# Altium project Smart_Clock.PrjPcb
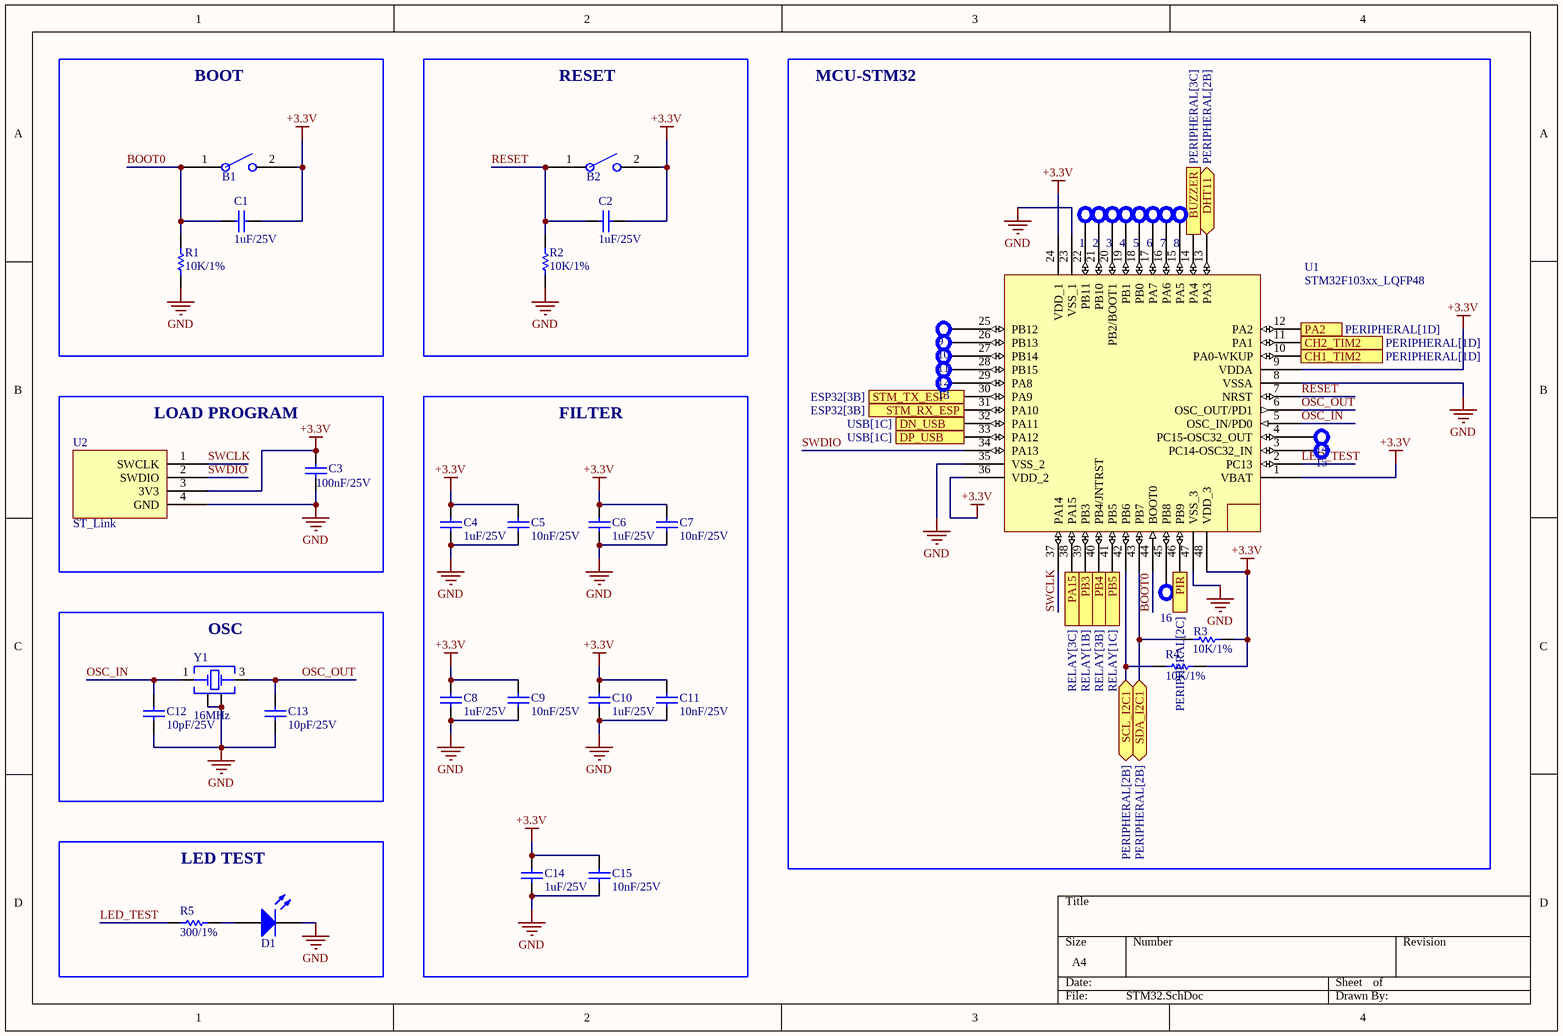
[diagram p0: STM32.SchDoc]
6 sheets, 123 parts. Net scope: flat (ports and power ports of the same name join across sheets).
Board file: Smart_Clock_PCB.PcbDoc
Sheets:
  STM32.SchDoc
  ESP32.SchDoc
  USB.SchDoc
  PERIPHERAL.SchDoc
  RELAY.SchDoc
  POWER_SUPPLY.SchDoc

## Sheet STM32.SchDoc
size A4; SheetNumber: 1; SheetTotal: 6

### Parts
1  Test Point  [TP]  (value not drawn)  (no BOM)
2  Test Point  [TP]  (value not drawn)  (no BOM)
3  Test Point  [TP]  (value not drawn)  (no BOM)
4  Test Point  [TP]  (value not drawn)  (no BOM)
5  Test Point  [TP]  (value not drawn)  (no BOM)
6  Test Point  [TP]  (value not drawn)  (no BOM)
7  Test Point  [TP]  (value not drawn)  (no BOM)
8  Test Point  [TP]  (value not drawn)  (no BOM)
9  Test Point  [TP]  (value not drawn)  (no BOM)
10  Test Point  [TP]  (value not drawn)  (no BOM)
11  Test Point  [TP]  (value not drawn)  (no BOM)
12  Test Point  [TP]  (value not drawn)  (no BOM)
13  Test Point  [TP]  (value not drawn)  (no BOM)
14  Test Point  [TP]  (value not drawn)  (no BOM)
15  Test Point  [TP]  (value not drawn)  (no BOM)
16  Test Point  [TP]  (value not drawn)  (no BOM)
B1  Button SMD 2 Pin 3x4mm  [BUTTON SMD 2 PIN]  (value not drawn)
B2  Button SMD 2 Pin 3x4mm  [BUTTON SMD 2 PIN]  (value not drawn)
C1  value 1uF/25V  [CAP-SM-0805]  (hidden comment: Cap Non-Pol SMD)
C2  value 1uF/25V  [CAP-SM-0805]  (hidden comment: Cap Non-Pol SMD)
C3  value 100nF/25V  [CAP-SM-0805]  (hidden comment: Cap Non-Pol SMD)
C4  value 1uF/25V  [CAP-SM-0805]  (hidden comment: Cap Non-Pol SMD)
C5  value 10nF/25V  [CAP-SM-0805]  (hidden comment: Cap Non-Pol SMD)
C6  value 1uF/25V  [CAP-SM-0805]  (hidden comment: Cap Non-Pol SMD)
C7  value 10nF/25V  [CAP-SM-0805]  (hidden comment: Cap Non-Pol SMD)
C8  value 1uF/25V  [CAP-SM-0805]  (hidden comment: Cap Non-Pol SMD)
C9  value 10nF/25V  [CAP-SM-0805]  (hidden comment: Cap Non-Pol SMD)
C10  value 1uF/25V  [CAP-SM-0805]  (hidden comment: Cap Non-Pol SMD)
C11  value 10nF/25V  [CAP-SM-0805]  (hidden comment: Cap Non-Pol SMD)
C12  value 10pF/25V  [CAP-SM-0805]  (hidden comment: Cap Non-Pol SMD)
C13  value 10pF/25V  [CAP-SM-0805]  (hidden comment: Cap Non-Pol SMD)
C14  value 1uF/25V  [CAP-SM-0805]  (hidden comment: Cap Non-Pol SMD)
C15  value 10nF/25V  [CAP-SM-0805]  (hidden comment: Cap Non-Pol SMD)
D1  LED SMD  [LED_0805_Blue]  (value not drawn)
R1  value 10K/1%  [RES-SM-0805]  (hidden comment: RESISTOR SMD)
R2  value 10K/1%  [RES-SM-0805]  (hidden comment: RESISTOR SMD)
R3  value 10K/1%  [RES-SM-0805]  (hidden comment: RESISTOR SMD)
R4  value 10K/1%  [RES-SM-0805]  (hidden comment: RESISTOR SMD)
R5  value 300/1%  [RES-SM-0805]  (hidden comment: RESISTOR SMD)
U1  STM32F103xx_LQFP48  [STM32_LQPF48]
U2  ST_Link  [Header 4 Pin]
Y1  16MHz  [WE-XTAL_CFPX-180]

### Blocks framed on the sheet
BOOT: B1 C1 R1
RESET: B2 C2 R2
LOAD PROGRAM: C3 U2
FILTER: C4-C11 C14 C15
OSC: C12 C13 Y1
LED TEST: D1 R5

### Ports
BUZZER (out, see PERIPHERAL[3C]), CH1_TIM2 (in, see PERIPHERAL[1D]), CH2_TIM2 (in, see PERIPHERAL[1D]), DHT11 (bidir, see PERIPHERAL[2B]), DN_USB (in, see USB[1C]), DP_USB (in, see USB[1C]), PA2 (in, see PERIPHERAL[1D]), PA15 (out, see RELAY[3C]), PB3 (out, see RELAY[1B]), PB4 (out, see RELAY[3B]), PB5 (out, see RELAY[1C]), PIR (in, see PERIPHERAL[2C]), SCL_I2C1 (bidir, see PERIPHERAL[2B]), SDA_I2C1 (bidir, see PERIPHERAL[2B]), STM_RX_ESP (in, see ESP32[3B]), STM_TX_ESP (out, see ESP32[3B])

### Nets
+3.3V: B1.2 B2.2 C1.2 C2.2 C3.2 C4.2 C5.2 C6.2 C7.2 C8.2 C9.2 C10.2 C11.2 C14.2 C15.2 R3.1 R4.1 U1.1(VBAT) U1.9(VDDA) U1.24(VDD_1) U1.36(VDD_2) U1.48(VDD_3) U2.3(3V3)
GND: C3.1 C4.1 C5.1 C6.1 C7.1 C8.1 C9.1 C10.1 C11.1 C12.2 C13.2 C14.1 C15.1 D1.2(K) R1.1 R2.1 U1.8(VSSA) U1.23(VSS_1) U1.35(VSS_2) U1.47(VSS_3) U2.4(GND) Y1.2(GND) Y1.4(GND)
BOOT0: B1.1 C1.1 R1.2 U1.44(BOOT0)
LED_TEST: R5.1 U1.2(PC13)
OSC_IN: C12.1 U1.5(OSC_IN/PD0) Y1.1(Crystal)
OSC_OUT: C13.1 U1.6(OSC_OUT/PD1) Y1.3(Crystal)
RESET: B2.1 C2.1 R2.2 U1.7(NRST)
SWCLK: U1.37(PA14) U2.1(SWCLK)
SWDIO: U1.34(PA13) U2.2(SWDIO)
Net1_1: 1.1 U1.22(PB11)
Net2_1: 2.1 U1.21(PB10)
Net3_1: 3.1 U1.20(PB2/BOOT1)
Net4_1: 4.1 U1.19(PB1)
Net5_1: 5.1 U1.18(PB0)
Net6_1: 6.1 U1.17(PA7)
Net7_1: 7.1 U1.16(PA6)
Net8_1: 8.1 U1.15(PA5)
Net9_1: 9.1 U1.25(PB12)
Net10_1: 10.1 U1.26(PB13)
Net11_1: 11.1 U1.27(PB14)
Net12_1: 12.1 U1.28(PB15)
Net13_1: 13.1 U1.29(PA8)
Net14_1: 14.1 U1.4(PC15-OSC32_OUT)
Net15_1: 15.1 U1.3(PC14-OSC32_IN)
Net16_1: 16.1 U1.45(PB8)
Net*1_27: U1.31(PA10) ; port STM_RX_ESP
Net*1_28: U1.30(PA9) ; port STM_TX_ESP
NetD1_1: D1.1(A) R5.2
NetD4_1: U1.46(PB9) ; port PIR
NetD7_2: U1.39(PB3) ; port PB3
NetD8_2: U1.40(PB4/JNTRST) ; port PB4
NetD11_2: U1.41(PB5) ; port PB5
NetD12_2: U1.38(PA15) ; port PA15
NetR3_2: R3.2 U1.43(PB7) ; port SDA_I2C1
NetR4_2: R4.2 U1.42(PB6) ; port SCL_I2C1
NetR11_1: U1.13(PA3) ; port DHT11
NetR12_1: U1.14(PA4) ; port BUZZER
NetSW1_5: U1.33(PA12) ; port DP_USB
NetSW1_8: U1.32(PA11) ; port DN_USB
NetU1_10: U1.10(PA0-WKUP) ; port CH1_TIM2
NetU1_11: U1.11(PA1) ; port CH2_TIM2
NetU1_12: U1.12(PA2) ; port PA2

### Notes on the sheet
- MCU-STM32

### Library data of the parts
B1 B2 = BUTTON
C1-C15 = Cap Non-Pol SMD: Capacitor
D1 = LED SMD: LED
R1-R5 = RESISTOR SMD: Resistor
Y1 = 073525166008: WE-XTAL Quartz Crystal, SMT, CFPX-180, 16MHz, +/-20ppm; Manufacturer Part Number: NX3225SA-16.000M-STD-CRS-2; Manufacturer: NDK; Frequency Stability: +/-50ppm; Load Capacitance: 8pF; Frequency Tolerance: +/-15ppm; ComponentLink2Description: Supplier 1 URL; ComponentLink2URL: https://www.mouser.com/ProductDetail/NDK/NX3225SA-16.000M-STD-CRS-2?qs=55YtniHzbhB2yRxaVPeqhg%3D%3D; Operating Temperature: -10 to +60degC; Size: CFPX-104/5032; Frequency: 16MHz; Mounting Technology: SMT; Supplier 3 Name: thegioiic; Supplier 3 SN: N/A; Supplier 3 URL: https://www.thegioiic.com/thach-anh-16mhz-5032-4-chan-smd; ComponentLink1Description: Datasheet link; ComponentLink1URL: https://www.mouser.com/datasheet/2/905/c_NX3225SA_e-1317523.pdf; ComponentLink3Description: Supplier 2 URL; ComponentLink3URL: https://www.digikey.com/en/products/detail/ndk-america-inc/NX3225SA-16-000M-STD-CRS-2/1788469; ComponentLink4Description: Supplier 3 URL; ComponentLink4URL: https://www.thegioiic.com/thach-anh-16mhz-5032-4-chan-smd; Supplier 1 Name: Mouser; Supplier 1 SN: 344-NX3225SA16MCRS2; Supplier 1 URL: https://www.mouser.com/ProductDetail/NDK/NX3225SA-16.000M-STD-CRS-2?qs=55YtniHzbhB2yRxaVPeqhg%3D%3D; Supplier 2 Name: Digi-Key; Supplier 2 SN: 644-1129-2-ND; Supplier 2 URL: https://www.digikey.com/en/products/detail/ndk-america-inc/NX3225SA-16-000M-STD-CRS-2/1788469; Value: 16MHz
1-16 = Test Point: Value: Test Point
U1 = STM32F103xx_LQFP48: Published: 30-May-2008; DatasheetVersion: rev6, Mar-2008; PackageVersion: Mar-2008; PackageReference: LQFP48; Publisher: Altium Limited; PackageDescription: 48-Pin Low-Profile Quad Flat Pack, 7 x 7 mm Body, 0.5 mm Pitch (LQFP48); ComponentLink1Description: Manufacturer Link; ComponentLink1URL: www.st.com/stm32; ComponentLink2Description: Datasheet; ComponentLink2URL: http://www.st.com/stonline/products/literature/ds/13587.pdf

## Sheet ESP32.SchDoc
size A; SheetNumber: 2; SheetTotal: 6
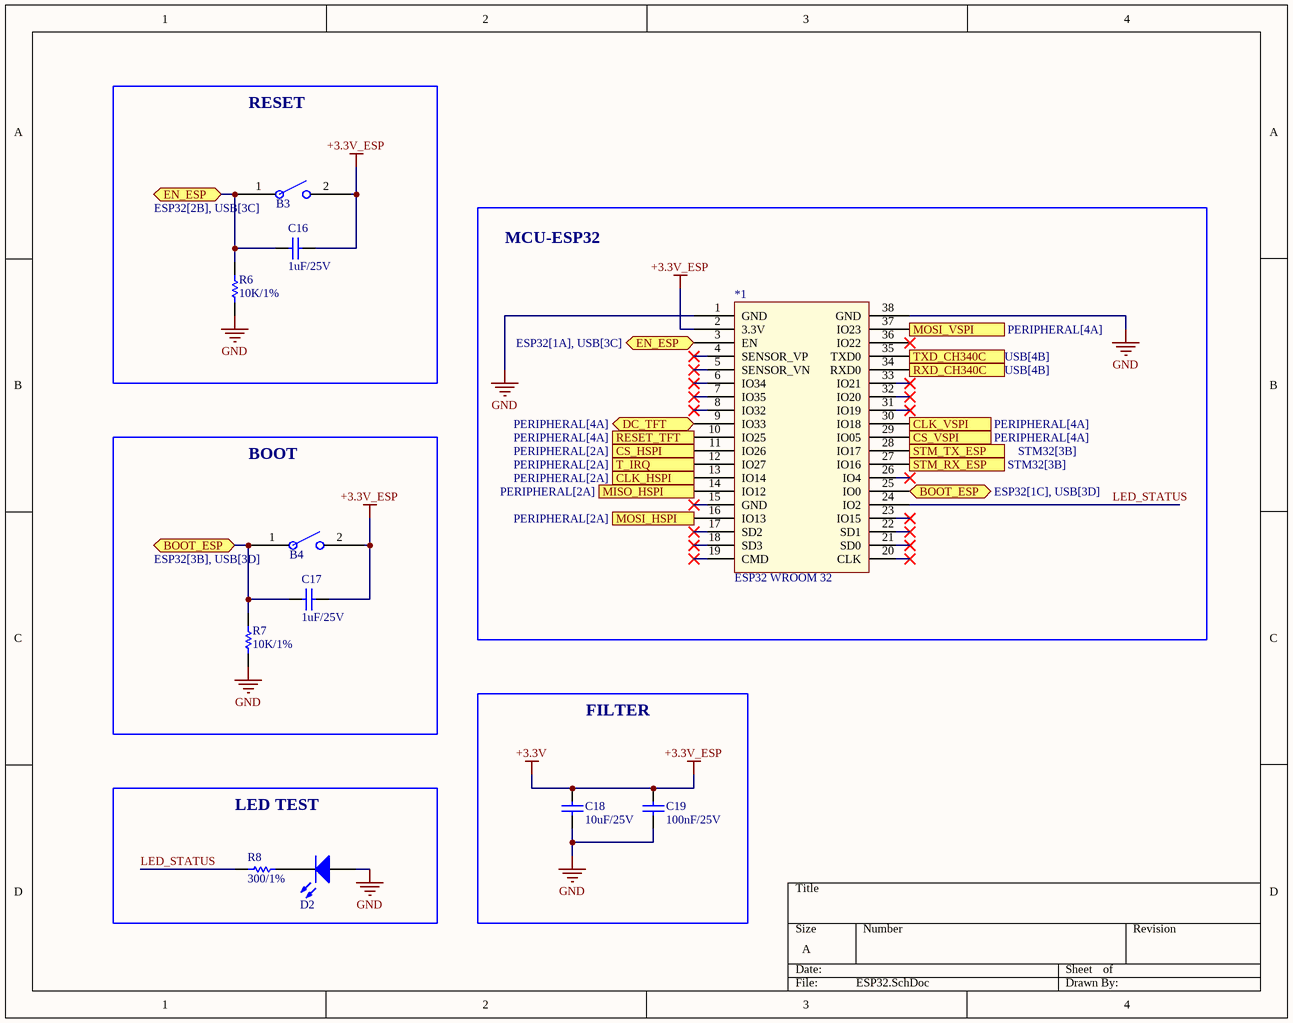
[diagram p1: ESP32.SchDoc]

### Parts
*1  ESP32 WROOM 32  [ESP32-WROOM-32D]
B3  Button SMD 2 Pin 3x4mm  [BUTTON SMD 2 PIN]  (value not drawn)
B4  Button SMD 2 Pin 3x4mm  [BUTTON SMD 2 PIN]  (value not drawn)
C16  value 1uF/25V  [CAP-SM-0805]  (hidden comment: Cap Non-Pol SMD)
C17  value 1uF/25V  [CAP-SM-0805]  (hidden comment: Cap Non-Pol SMD)
C18  value 10uF/25V  [CAP-SM-0805]  (hidden comment: Cap Non-Pol SMD)
C19  value 100nF/25V  [CAP-SM-0805]  (hidden comment: Cap Non-Pol SMD)
D2  LED SMD  [LED_0805_Blue]  (value not drawn)
R6  value 10K/1%  [RES-SM-0805]  (hidden comment: RESISTOR SMD)
R7  value 10K/1%  [RES-SM-0805]  (hidden comment: RESISTOR SMD)
R8  value 300/1%  [RES-SM-0805]  (hidden comment: RESISTOR SMD)

### Blocks framed on the sheet
RESET: B3 C16 R6
MCU-ESP32: *1
BOOT: B4 C17 R7
FILTER: C18 C19
LED TEST: D2 R8

### Ports
BOOT_ESP (bidir, see ESP32[1C], USB[3D]), BOOT_ESP (bidir, see ESP32[3B], USB[3D]), CLK_HSPI (out, see PERIPHERAL[2A]), CLK_VSPI (out, see PERIPHERAL[4A]), CS_HSPI (out, see PERIPHERAL[2A]), CS_VSPI (out, see PERIPHERAL[4A]), DC_TFT (bidir, see PERIPHERAL[4A]), EN_ESP (bidir, see ESP32[1A], USB[3C]), EN_ESP (bidir, see ESP32[2B], USB[3C]), MISO_HSPI (in, see PERIPHERAL[2A]), MOSI_HSPI (out, see PERIPHERAL[2A]), MOSI_VSPI (out, see PERIPHERAL[4A]), RESET_TFT (out, see PERIPHERAL[4A]), RXD_CH340C (out, see USB[4B]), STM_RX_ESP (out, see STM32[3B]), STM_TX_ESP (in, see STM32[3B]), T_IRQ (in, see PERIPHERAL[2A]), TXD_CH340C (in, see USB[4B])

### Nets
+3.3V: *1.2(3.3V) B3.2 B4.2 C16.2 C17.2 C18.2 C19.2  [also labelled +3.3V_ESP]
GND: *1.1(GND) *1.38(GND) C18.1 C19.1 D2.1(A) R6.1 R7.1
LED_STATUS: *1.24(IO2) R8.1
Net*1_3: *1.3(EN) B3.1 C16.1 R6.2 ; port EN_ESP
Net*1_9: *1.9(IO33) ; port DC_TFT
Net*1_10: *1.10(IO25) ; port RESET_TFT
Net*1_11: *1.11(IO26) ; port CS_HSPI
Net*1_12: *1.12(IO27) ; port T_IRQ
Net*1_13: *1.13(IO14) ; port CLK_HSPI
Net*1_14: *1.14(IO12) ; port MISO_HSPI
Net*1_16: *1.16(IO13) ; port MOSI_HSPI
Net*1_25: *1.25(IO0) B4.1 C17.1 R7.2 ; port BOOT_ESP
Net*1_27: *1.27(IO16) ; port STM_RX_ESP
Net*1_28: *1.28(IO17) ; port STM_TX_ESP
Net*1_29: *1.29(IO05) ; port CS_VSPI
Net*1_30: *1.30(IO18) ; port CLK_VSPI
Net*1_34: *1.34(RXD0) ; port RXD_CH340C
Net*1_35: *1.35(TXD0) ; port TXD_CH340C
Net*1_37: *1.37(IO23) ; port MOSI_VSPI
NetD2_2: D2.2(K) R8.2

Not connected (* = marked no-connect by the designer): *1 4(SENSOR_VP)* 5(SENSOR_VN)* 6(IO34)* 7(IO35)* 8(IO32)* 15(GND)* 17(SD2)* 18(SD3)* 19(CMD)* 20(CLK)* 21(SD0)* 22(SD1)* 23(IO15)* 26(IO4)* 31(IO19)* 32(IO20)* 33(IO21)* 36(IO22)*

### Library data of the parts
B3 B4 = BUTTON
C16-C19 = Cap Non-Pol SMD: Capacitor
D2 = LED SMD: LED
R6-R8 = RESISTOR SMD: Resistor

## Sheet USB.SchDoc
size A; SheetNumber: 3; SheetTotal: 6
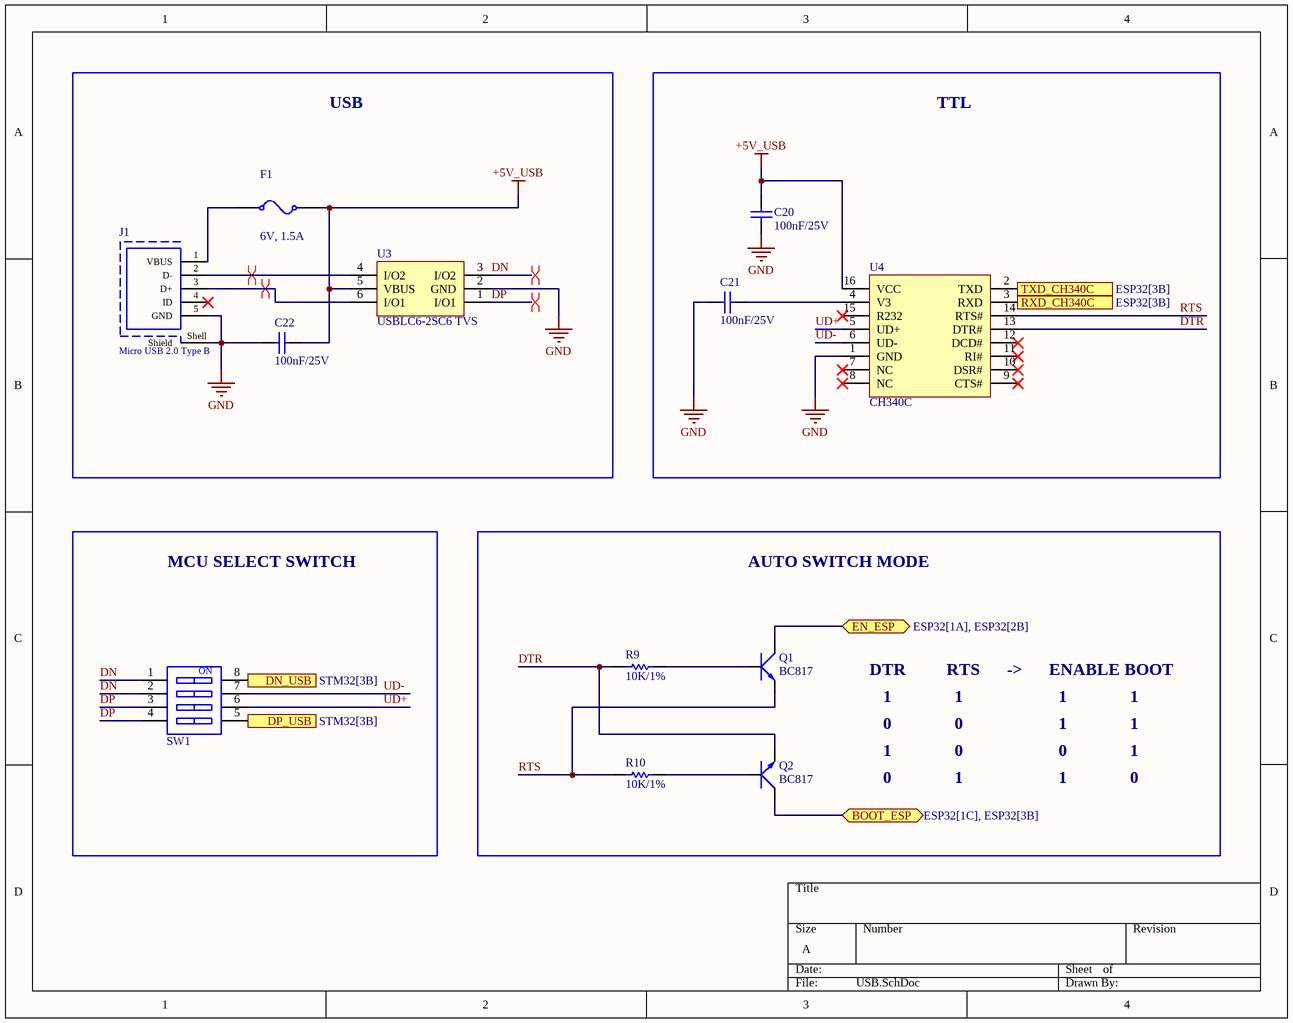
[diagram p2: USB.SchDoc]

### Parts
C20  value 100nF/25V  [CAP-SM-0805]  (hidden comment: Cap Non-Pol SMD)
C21  value 100nF/25V  [CAP-SM-0805]  (hidden comment: Cap Non-Pol SMD)
C22  value 100nF/25V  [CAP-SM-0805]  (hidden comment: Cap Non-Pol SMD)
F1  6V, 1.5A  [Fuse_SMD_1812]
J1  Micro USB 2.0 Type B  [629105150521]
Q1  BC817  [SOT-23]
Q2  BC817  [SOT-23]
R9  value 10K/1%  [RES-SM-0805]  (hidden comment: RESISTOR SMD)
R10  value 10K/1%  [RES-SM-0805]  (hidden comment: RESISTOR SMD)
SW1  418117270904  [418117270904]  (value not drawn)
U3  USBLC6-2SC6 TVS  [SOT23-6]
U4  CH340C  [SOIC16_50_284_25X90_SMT]

### Blocks framed on the sheet
USB: C22 F1 J1 U3
MCU SELECT SWITCH: SW1

### Ports
BOOT_ESP (bidir, see ESP32[1C], ESP32[3B]), DN_USB (out, see STM32[3B]), DP_USB (out, see STM32[3B]), EN_ESP (bidir, see ESP32[1A], ESP32[2B]), RXD_CH340C (in, see ESP32[3B]), TXD_CH340C (out, see ESP32[3B])

### Nets
+5V_USB: C20.1 C22.2 F1.1 U3.5(VBUS) U4.16(VCC)
GND: C20.2 C21.2 C22.1 J1.5(GND) J1.Shell(Shield) U3.2(GND) U4.1(GND)
DN: SW1.1 SW1.2 U3.3(I/O2)
DP: SW1.3 SW1.4 U3.1(I/O1)
DTR: Q2.2(E) R9.1 U4.13(DTR#)
RTS: Q1.2(E) R10.1 U4.14(RTS#)
UD+: SW1.6 U4.5(UD+)
UD-: SW1.7 U4.6(UD-)
Net*1_3: Q1.3(C) ; port EN_ESP
Net*1_25: Q2.3(C) ; port BOOT_ESP
Net*1_34: U4.3(RXD) ; port RXD_CH340C
Net*1_35: U4.2(TXD) ; port TXD_CH340C
NetC21_1: C21.1 U4.4(V3)
NetF1_0: F1.0 J1.1(VBUS)
NetJ1_2: J1.2(D-) U3.4(I/O2)
NetJ1_3: J1.3(D+) U3.6(I/O1)
NetQ1_1: Q1.1(B) R9.2
NetQ2_1: Q2.1(B) R10.2
NetSW1_5: SW1.5 ; port DP_USB
NetSW1_8: SW1.8 ; port DN_USB

Not connected (* = marked no-connect by the designer): J1 4(ID)*; U4 7(NC)* 8(NC)* 9(CTS#)* 10(DSR#)* 11(RI#)* 12(DCD#)* 15(R232)*

### Layout directives
differential pair: DN, DP, NetJ1_2, NetJ1_3

### Notes on the sheet
- TTL
- AUTO SWITCH MODE
- DTR         RTS      ->      ENABLE BOOT
- 1              1
- 0              0
- 1              0
- 0              1
- (in symbol 418117270904) ON

### Library data of the parts
C20-C22 = Cap Non-Pol SMD: Capacitor
F1 = 061812150024: Resettable Fuse, Size 1812, 24V, 1.5A; Manufacturer: Littelfuse; Threshold Current: 20A; Trip Current: 3A; Threshold Voltage: 24V; Hold Current: 1.5A; Size: 1812; Mounting Technology: SMT/SMD; ComponentLink1Description: Datasheet link; ComponentLink1URL: https://www.littelfuse.com/~/media/electronics/product_specifications/resettable_ptcs/littelfuse_ptc_minismdc300f_2_product_specification.pdf.pdf; ComponentLink2Description: Supplier 1 URL; ComponentLink2URL: https://www.mouser.vn/ProductDetail/Littelfuse/MINISMDC150F-24-2?qs=F6FIpiMdEVZ%2Fp37J%2FDHAxA%3D%3D; ComponentLink3Description: Supplier 2 URL; ComponentLink3URL: https://www.digikey.com/en/products/detail/littelfuse-inc/MINISMDC150F-24-2/1113513?s=N4IgTCBcDaILIEkByCDKcAiBhAjAVgAYAxAejABYBaCAXQF8g; ComponentLink4Description: Supplier 3 URL; ComponentLink4URL: https://www.thegioiic.com/cau-chi-tu-phuc-hoi-1812-24v-1-5a; Supplier 1 Name: Mouser; Supplier 1 SN: 650-MINISMDC150F/24; Supplier 1 URL: https://www.mouser.vn/ProductDetail/Littelfuse/MINISMDC150F-24-2?qs=F6FIpiMdEVZ%2Fp37J%2FDHAxA%3D%3D; Supplier 2 Name: Digi-Key; Supplier 2 SN: MINISMDC150F24-2TR-ND; Supplier 2 URL: https://www.mouser.vn/ProductDetail/Littelfuse/MINISMDC150F-24-2?qs=F6FIpiMdEVZ%2Fp37J%2FDHAxA%3D%3D; Supplier 3 Name: thegioiic; Supplier 3 SN: N/A; Supplier 3 URL: https://www.thegioiic.com/cau-chi-tu-phuc-hoi-1812-24v-1-5a; Value: 24V, 1.5A
J1 = 629105150521: Micro USB 2.0 Type B Receptacle WR-COM, Horizontal, SMT, with Pegs, High Current at Pin 1 & Pin 5; Rated Current: 3 A; Contact Resistance: 30 mOhm; Working Voltage: 30 VAC; ComponentLink1Description: Datasheet; ComponentLink1URL: https://katalog.we-online.de/em/datasheet/629105150521.pdf; ComponentLink2Description: Supplier 1 URL; ComponentLink2URL: N/A; Part Number: 629105150521; Published Date: September 2018; Publisher: Wurth Elektronik; Orientation: Horizontal; Connector Type: Micro USB 2.0 Type B; Operating Temperature: -40 to 85 degC; Mounting Technology: SMT; Gender: Receptacle; Packaging: Tape and Reel; ComponentLink3Description: Supplier 2 URL; ComponentLink3URL: N/A; ComponentLink4Description: Supplier 3 URL; ComponentLink4URL: N/A; Supplier 1 Name: Mouser; Supplier 1 SN: 710-629105150521; Supplier 1 URL: https://www.mouser.vn/ProductDetail/Wurth-Elektronik/629105150521?qs=a9WhcLg8qCzXiH7kZP8GRQ%3D%3D; Supplier 2 Name: Digi-Key; Supplier 2 SN: N/A; Supplier 2 URL: N/A; Supplier 3 Name: thegioiic; Supplier 3 SN: N/A; Supplier 3 URL: N/A; Value: Micro USB 2.0 Type B
Q1 Q2 = Trans BC817: SOT-23 - C8658; Value: C9014
R9 R10 = RESISTOR SMD: Resistor
SW1 = 418117270904: WS-DITV Compact THT Dip Switch, Raised Actuator, pitch 2.54mm, 4p; Manufacturer: Wurth Elektronik; Actuator Type: Raise Type; Operation Force: 800g; Rated Current Non-Switching: 100mA; Rated Current Switching: 25mA; Rated Voltage Non-Switching: 50VDC; Rated Voltage Switching: 24VDC; Number of Poles: 4; ComponentLink2Description: Datasheet Link; ComponentLink2URL: https://www.we-online.com/redexpert/spec/418117270904?ad; Manufacturer Part Number: 418117270904; Category: Dip Switches; Match Code: WS-DITV; Mount: Through Hole; Operating Temperature Max: 85°C; Operating Temperature Min: -40°C; Packaging: Tube; Contact Material: Copper Alloy; Contact Plating: Gold; Pitch: 2.54mm; Supplier 1 Name: Mouser; Supplier 1 SN: 710-418117270904; Supplier 1 URL: https://www.mouser.com/ProductDetail/Wurth-Elektronik/418117270904?qs=wr8lucFkNMUW2I6n2hVTKw%3D%3D; Supplier 2 Name: Digi-Key; Supplier 2 SN: 732-3834-5-ND; Supplier 2 URL: https://www.digikey.com/en/products/detail/w%C3%BCrth-elektronik/418117270904/3174489; Supplier 3 Name: Thegioiic; Supplier 3 SN: N/A; Supplier 3 URL: https://www.thegioiic.com/cong-tac-4-bit-dip-switch-xuyen-lo-2-54mm-mau-do
U3 = IC_LTC6992IS6-1: Oscillator, Silicon IC 3.81Hz ~ 1MHz TSOT-23-6; Manufacturer: Linear Technology/Analog Devices; Alternate Part Number-1: NA; Manufacturer Part Number: LTC6992IS6-1; Case/Package: SOT-23-6; Supplier-1: Arrow; Supplier Part Number-1: LTC6992IS6-1#TRMPBF
U4 = CH340C: USB Bridge, USB to UART USB 2.0 UART Interface; Manufacturer: Olimex; Alternate Part Number-1: NA; Manufacturer Part Number: CH340C; Case/Package: SOIC16; Supplier-1: LCSC; Supplier Part Number-1: C84681

## Sheet PERIPHERAL.SchDoc
size A; SheetNumber: 4; SheetTotal: 6
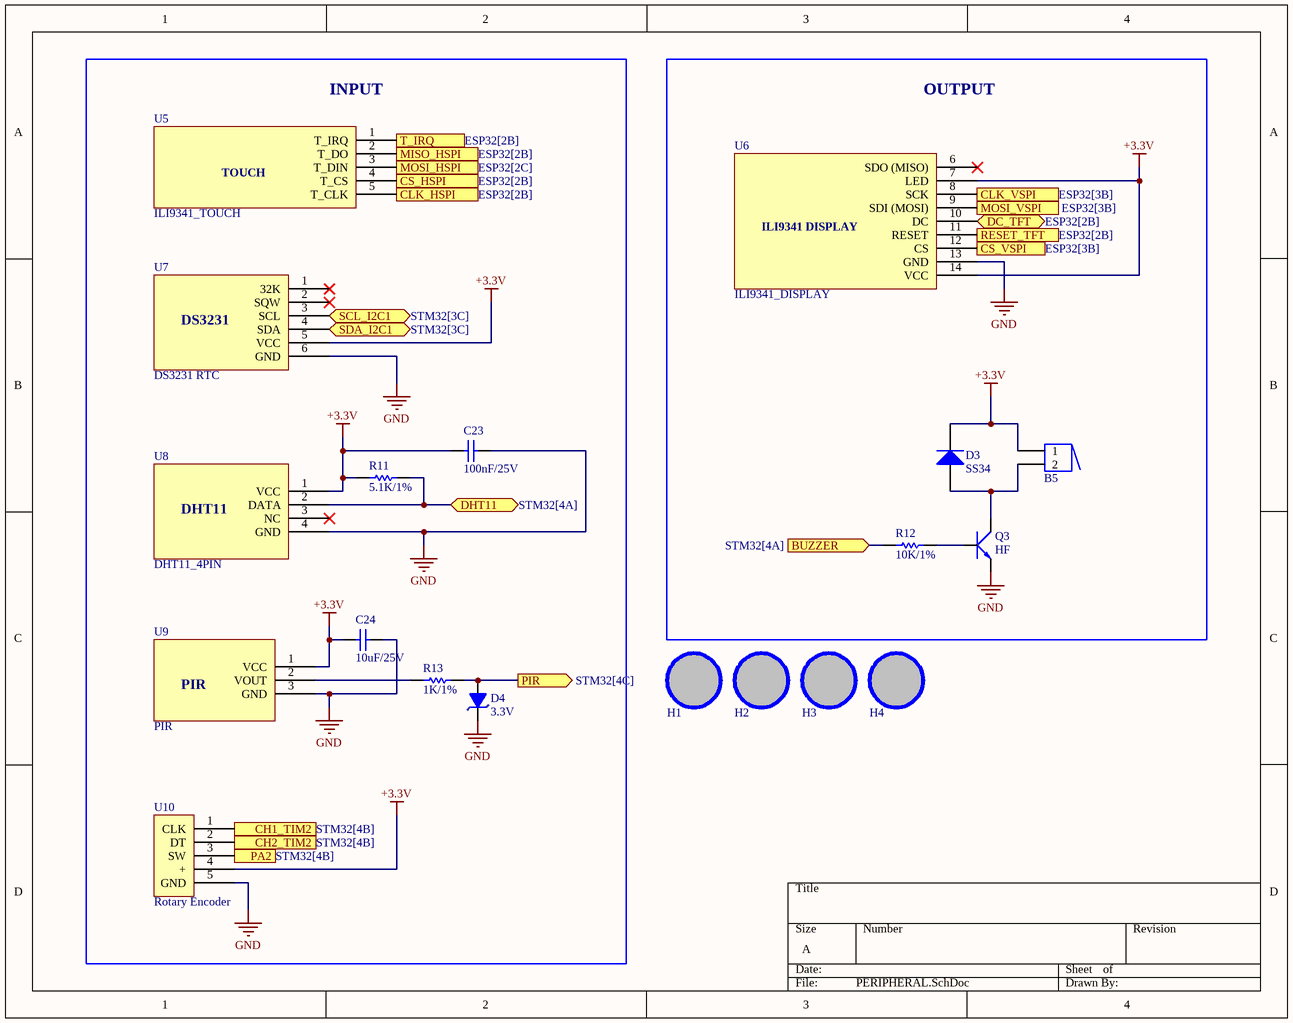
[diagram p3: PERIPHERAL.SchDoc]

### Parts
B5  Buzzer  [BUZZER]  (value not drawn)
C23  value 100nF/25V  [CAP-SM-0805]  (hidden comment: Cap Non-Pol SMD)
C24  value 10uF/25V  [CAP-SM-0805]  (hidden comment: Cap Non-Pol SMD)
D3  SS34  [DIODE SMA]
D4  3.3V  [DIODE ZENNER SMD SOD80]
H1  Hole  [LO KHOAN 3MM]  (value not drawn)
H2  Hole  [LO KHOAN 3MM]  (value not drawn)
H3  Hole  [LO KHOAN 3MM]  (value not drawn)
H4  Hole  [LO KHOAN 3MM]  (value not drawn)
Q3  HF  [SOT-23]
R11  value 5.1K/1%  [RES-SM-0805]  (hidden comment: RESISTOR SMD)
R12  value 10K/1%  [RES-SM-0805]  (hidden comment: RESISTOR SMD)
R13  value 1K/1%  [RES-SM-0805]  (hidden comment: RESISTOR SMD)
U5  ILI9341_TOUCH  [Header 5 Pin]
U6  ILI9341_DISPLAY  [HEADER 9 PIN]
U7  DS3231 RTC  [header 6 pin]
U8  DHT11_4PIN  [Header 4 Pin]
U9  PIR  [Header 3 Pin]
U10  Rotary Encoder  [Header 5 Pin]

### Blocks framed on the sheet
INPUT: C23 C24 D4 R11 R13 U5 U7-U10
OUTPUT: B5 D3 Q3 R12 U6

### Ports
BUZZER (in, see STM32[4A]), CH1_TIM2 (out, see STM32[4B]), CH2_TIM2 (out, see STM32[4B]), CLK_HSPI (in, see ESP32[2B]), CLK_VSPI (in, see ESP32[3B]), CS_HSPI (in, see ESP32[2B]), CS_VSPI (in, see ESP32[3B]), DC_TFT (bidir, see ESP32[2B]), DHT11 (bidir, see STM32[4A]), MISO_HSPI (out, see ESP32[2B]), MOSI_HSPI (in, see ESP32[2C]), MOSI_VSPI (in, see ESP32[3B]), PA2 (out, see STM32[4B]), PIR (out, see STM32[4C]), RESET_TFT (in, see ESP32[2B]), SCL_I2C1 (bidir, see STM32[3C]), SDA_I2C1 (bidir, see STM32[3C]), T_IRQ (out, see ESP32[2B])

### Nets
+3.3V: B5.1 C23.2 C24.2 D3.2(K) R11.2 U6.7(LED) U6.14(VCC) U7.5(VCC) U8.1(VCC) U9.1(VCC) U10.4(+)
GND: C23.1 C24.1 D4.2(K) Q3.2(E) U6.13(GND) U7.6(GND) U8.4(GND) U9.3(GND) U10.5(GND)
Net*1_9: U6.10(DC) ; port DC_TFT
Net*1_10: U6.11(RESET) ; port RESET_TFT
Net*1_11: U5.4(T_CS) ; port CS_HSPI
Net*1_12: U5.1(T_IRQ) ; port T_IRQ
Net*1_13: U5.5(T_CLK) ; port CLK_HSPI
Net*1_14: U5.2(T_DO) ; port MISO_HSPI
Net*1_16: U5.3(T_DIN) ; port MOSI_HSPI
Net*1_29: U6.12(CS) ; port CS_VSPI
Net*1_30: U6.8(SCK) ; port CLK_VSPI
Net*1_37: U6.9(SDI_(MOSI)) ; port MOSI_VSPI
NetB5_2: B5.2 D3.1(A) Q3.3(C)
NetD4_1: D4.1(A) R13.2 ; port PIR
NetQ3_1: Q3.1(B) R12.2
NetR3_2: U7.4(SDA) ; port SDA_I2C1
NetR4_2: U7.3(SCL) ; port SCL_I2C1
NetR11_1: R11.1 U8.2(DATA) ; port DHT11
NetR12_1: R12.1 ; port BUZZER
NetR13_1: R13.1 U9.2(VOUT)
NetU1_10: U10.1(CLK) ; port CH1_TIM2
NetU1_11: U10.2(DT) ; port CH2_TIM2
NetU1_12: U10.3(SW) ; port PA2

Not connected (* = marked no-connect by the designer): H1 1; H2 1; H3 1; H4 1; U6 6(SDO_(MISO))*; U7 1(32K)* 2(SQW)*; U8 3(NC)*

### Notes on the sheet
- (in symbol DHT11_4PIN) DHT11
- (in symbol ILI9341_DISPLAY) ILI9341 DISPLAY
- (in symbol ILI9341_TOUCH) TOUCH

### Library data of the parts
C23 C24 = Cap Non-Pol SMD: Capacitor
D3 = Diode SS34 ( 1N5822 ): Dán; Don_Vi: Con; Ma_Hang: MH002104; Ten_Linh_Kien: Diode SS34 3A 40V SMA ( 1N5822 SS34A); Kieu_Chan: *; Chung_Loai: Dán
D4 = Diode Zener 3.3V: Dán; Don_Vi: Con; Ma_Hang: MH002880; Ten_Linh_Kien: Diode Zener 1/2W 3.3V SMD1206 ZMM3.3; Kieu_Chan: *; Ghi_Chu: *; Chung_Loai: Dán
H1-H4 = Hole: Hole 3mm
Q3 = Trans C1815 HF SMD: SOT-23; Value: C9014
R11-R13 = RESISTOR SMD: Resistor
U7 = DS3231: DS3231 RTC Module

## Sheet RELAY.SchDoc
size A; SheetNumber: 5; SheetTotal: 6
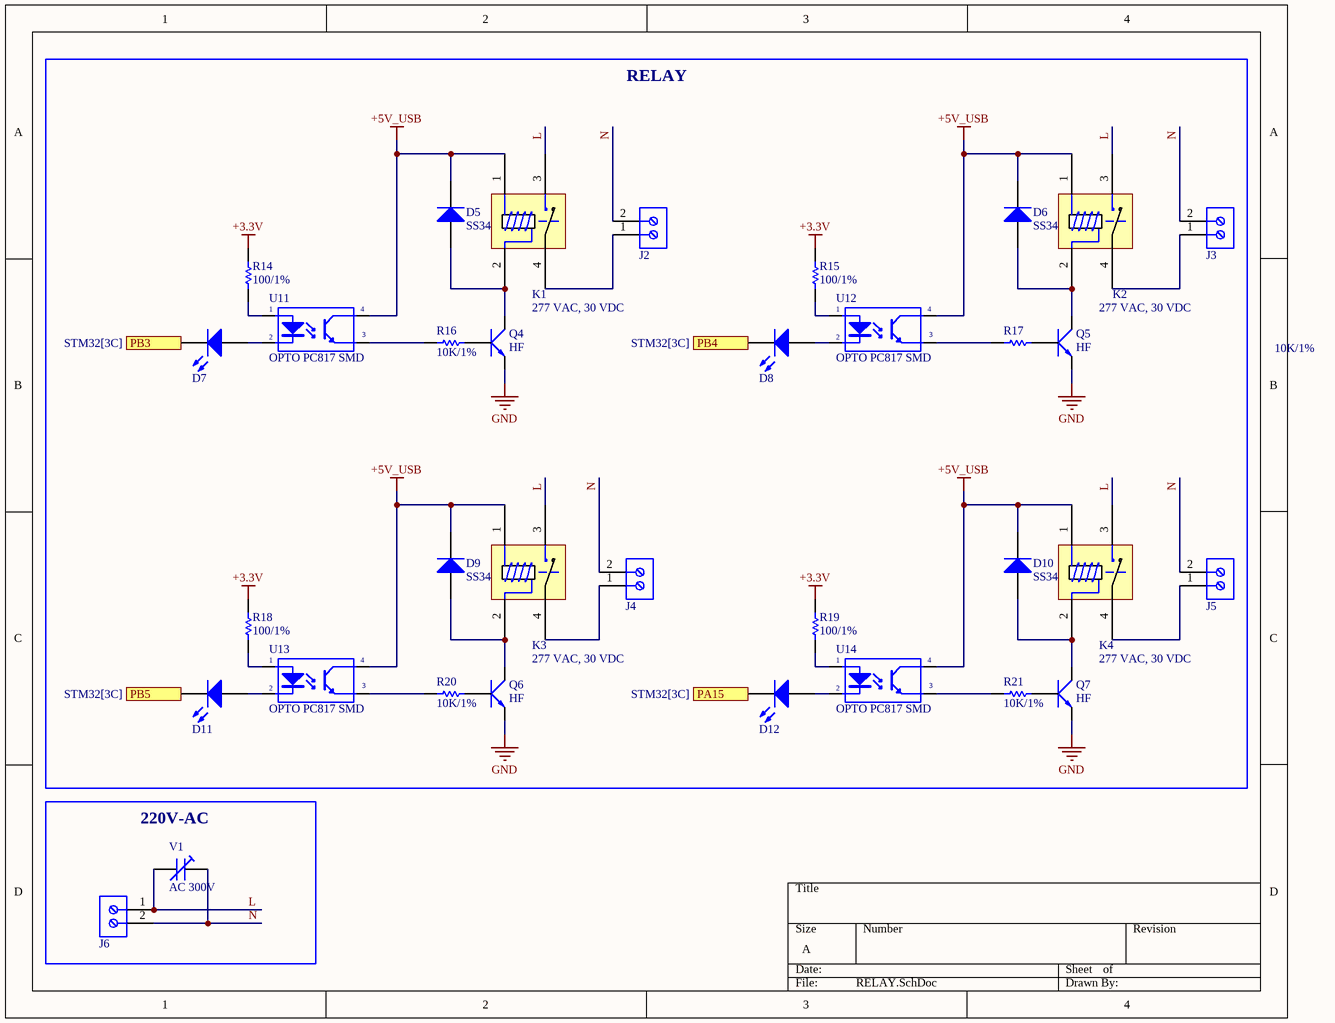
[diagram p4: RELAY.SchDoc]

### Parts
D5  SS34  [DIODE SMA]
D6  SS34  [DIODE SMA]
D7  LED SMD  [LED_0805_Blue]  (value not drawn)
D8  LED SMD  [LED_0805_Blue]  (value not drawn)
D9  SS34  [DIODE SMA]
D10  SS34  [DIODE SMA]
D11  LED SMD  [LED_0805_Blue]  (value not drawn)
D12  LED SMD  [LED_0805_Blue]  (value not drawn)
J2  10A, 300V  [691214110002]  (value not drawn)
J3  10A, 300V  [691214110002]  (value not drawn)
J4  10A, 300V  [691214110002]  (value not drawn)
J5  10A, 300V  [691214110002]  (value not drawn)
J6  10A, 300V  [691214110002]  (value not drawn)
K1  277 VAC, 30 VDC  [HF46F]
K2  277 VAC, 30 VDC  [HF46F]
K3  277 VAC, 30 VDC  [HF46F]
K4  277 VAC, 30 VDC  [HF46F]
Q4  HF  [SOT-23]
Q5  HF  [SOT-23]
Q6  HF  [SOT-23]
Q7  HF  [SOT-23]
R14  value 100/1%  [RES-SM-0805]  (hidden comment: RESISTOR SMD)
R15  value 100/1%  [RES-SM-0805]  (hidden comment: RESISTOR SMD)
R16  value 10K/1%  [RES-SM-0805]  (hidden comment: RESISTOR SMD)
R17  value 10K/1%  [RES-SM-0805]  (hidden comment: RESISTOR SMD)
R18  value 100/1%  [RES-SM-0805]  (hidden comment: RESISTOR SMD)
R19  value 100/1%  [RES-SM-0805]  (hidden comment: RESISTOR SMD)
R20  value 10K/1%  [RES-SM-0805]  (hidden comment: RESISTOR SMD)
R21  value 10K/1%  [RES-SM-0805]  (hidden comment: RESISTOR SMD)
U11  OPTO PC817 SMD  [SOP4]
U12  OPTO PC817 SMD  [SOP4]
U13  OPTO PC817 SMD  [SOP4]
U14  OPTO PC817 SMD  [SOP4]
V1  AC 300V  [Varistor]

### Blocks framed on the sheet
RELAY: D5-D12 J2-J5 K1-K4 Q4-Q7 R14-R21 U11-U14
220V-AC: J6 V1

### Ports
PA15 (in, see STM32[3C]), PB3 (in, see STM32[3C]), PB4 (in, see STM32[3C]), PB5 (in, see STM32[3C])

### Nets
+3.3V: R14.2 R15.2 R18.2 R19.2
+5V_USB: D5.2(K) D6.2(K) D9.2(K) D10.2(K) K1.1(Coil) K2.1(Coil) K3.1(Coil) K4.1(Coil) U11.4(C) U12.4(C) U13.4(C) U14.4(C)
GND: Q4.2(E) Q5.2(E) Q6.2(E) Q7.2(E)
L: J6.1 K1.3(NO) K2.3(NO) K3.3(NO) K4.3(NO) V1.1
N: J2.2 J3.2 J4.2 J5.2 J6.2 V1.2
NetD5_1: D5.1(A) K1.2(Coil) Q4.3(C)
NetD6_1: D6.1(A) K2.2(Coil) Q5.3(C)
NetD7_1: D7.1(A) U11.2(K)
NetD7_2: D7.2(K) ; port PB3
NetD8_1: D8.1(A) U12.2(K)
NetD8_2: D8.2(K) ; port PB4
NetD9_1: D9.1(A) K3.2(Coil) Q6.3(C)
NetD10_1: D10.1(A) K4.2(Coil) Q7.3(C)
NetD11_1: D11.1(A) U13.2(K)
NetD11_2: D11.2(K) ; port PB5
NetD12_1: D12.1(A) U14.2(K)
NetD12_2: D12.2(K) ; port PA15
NetJ2_1: J2.1 K1.4
NetJ3_1: J3.1 K2.4
NetJ4_1: J4.1 K3.4
NetJ5_1: J5.1 K4.4
NetQ4_1: Q4.1(B) R16.1
NetQ5_1: Q5.1(B) R17.1
NetQ6_1: Q6.1(B) R20.1
NetQ7_1: Q7.1(B) R21.1
NetR14_1: R14.1 U11.1(A)
NetR15_1: R15.1 U12.1(A)
NetR16_2: R16.2 U11.3(E)
NetR17_2: R17.2 U12.3(E)
NetR18_1: R18.1 U13.1(A)
NetR19_1: R19.1 U14.1(A)
NetR20_2: R20.2 U13.3(E)
NetR21_2: R21.2 U14.3(E)

### Library data of the parts
D5 D6 D9 D10 = Diode SS34 ( 1N5822 ): as D3 on sheet PERIPHERAL; Kieu_Chan: *; Chung_Loai: Dán
D7 D8 D11 D12 = LED SMD: LED
J2-J6 = 691214110002: WR-TBL Series 2141 Horizontal Entry Modular, THT, pitch 3.5mm, 2p; Manufacturer: Wurth Elektronik; Modularity: Yes; ComponentLink1Description: Website Link; ComponentLink1URL: https://www.we-online.com/redexpert/article/691214110002?ad; ComponentLink2Description: Supplier 1 URL; ComponentLink2URL: N/A; Manufacturer Part Number: 691214110002; Category: Terminal Blocks; Match Code: WR-TBL; Mount: Through Hole; Operating Temperature Max: 105°C; Operating Temperature Min: -40°C; Packaging: Box; Application: Rising Cage Clamp; Number of Pins: 2; Number of Rows: 1; Orientation: Horizontal; Pitch: 3.5mm; Rated Current: 10A; Working Voltage: 300V; ComponentLink3Description: Supplier 2 URL; ComponentLink3URL: N/A; ComponentLink4Description: Supplier 3 URL; ComponentLink4URL: https://www.thegioiic.com/kf350-2-v-domino-2-chan-thang-3-5mm-300v-10a-han-pcb; Supplier 1 Name: Mouser; Supplier 1 SN: N/A; Supplier 1 URL: N/A; Supplier 2 Name: Digi-Key; Supplier 2 SN: N/A; Supplier 2 URL: N/A; Supplier 3 Name: thegioiic; Supplier 3 SN: N/A; Supplier 3 URL: https://www.thegioiic.com/kf350-2-v-domino-2-chan-thang-3-5mm-300v-10a-han-pcb; Value: 10A, 300V
K1-K4 = HF46F-G 12-HS1: Coil Voltage: 12 VDC; Contact Current Rating: 7A; Switching Voltage Max: 277 VAC, 30 VDC; Coil Voltage: 12 VDC; Associated Relay Series: N/A; Coil Current: N/A; Coil Resistance: N/A; ComponentLink1Description: Datasheet link; ComponentLink1URL: https://source.hongfa.com//pdf/web/viewer.html?file=/Uploads/Product/PDF/HF46F-G_en.pdf?timestamp=1691116874; ComponentLink2Description: Supplier 1 URL; ComponentLink2URL: N/A; ComponentLink3Description: Supplier 2 URL; ComponentLink3URL: N/A; ComponentLink4Description: Supplier 3 URL; ComponentLink4URL: https://www.thegioiic.com/hf46f-g-12-hs1-ro-le-12vdc-7a-spst-no-4-chan; Power Consumption: N/A; Supplier 1 Name: Mouser; Supplier 1 SN: N/A; Supplier 1 URL: N/A; Supplier 2 Name: Digi-Key; Supplier 2 SN: N/A; Supplier 2 URL: N/A; Supplier 3 Name: thegioiic; Supplier 3 SN: N/A; Supplier 3 URL: https://www.thegioiic.com/hf46f-g-12-hs1-ro-le-12vdc-7a-spst-no-4-chan; Value: 277 VAC, 30 VDC
Q4-Q7 = Trans C1815 HF SMD: SOT-23; Value: C9014
R14-R21 = RESISTOR SMD: Resistor
U11-U14 = OPTO PC817 SMD: Single Opto; Value: PC817
V1 = 05000730110: Varistors 7D471K AC 300V; Manufacture  Name: Bourns; Tolerance: +/- 10%; Diameter: 7mm; Capacitance: N/A; ComponentLink1Description: Datasheet link; ComponentLink1URL: N/A; Voltage: 300V; Manufacture  SN: 7D471K; ComponentLink2Description: Supplier 1 URL; ComponentLink2URL: N/A; ComponentLink3Description: Supplier 2 URL; ComponentLink3URL: N/A; ComponentLink4Description: Supplier 3 URL; ComponentLink4URL: N/A; Supplier 1 Name: Mouser; Supplier 1 SN: N/A; Supplier 1 URL: N/A; Supplier 2 Name: Digi-Key; Supplier 2 SN: N/A; Supplier 2 URL: N/A; Supplier 3 Name: thegioiic; Supplier 3 SN: N/A; Supplier 3 URL: https://www.thegioiic.com/tu-chong-set-varistor-7d471k-300v; Value: AC 300V

## Sheet POWER_SUPPLY.SchDoc
size A; SheetNumber: 6; SheetTotal: 6
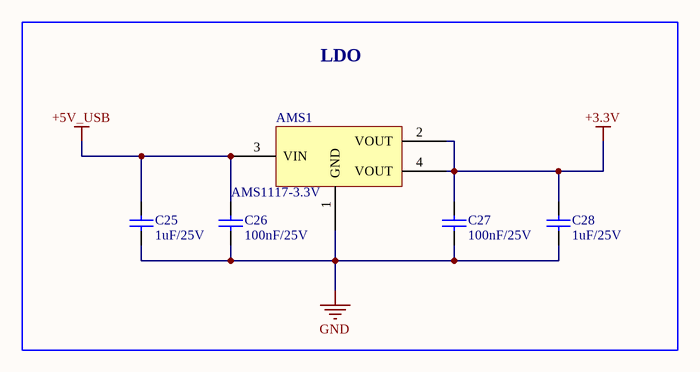
[diagram p5: POWER_SUPPLY.SchDoc]

### Parts
AMS1  AMS1117-3.3V  [SOT223]
C25  value 1uF/25V  [CAP-SM-0805]  (hidden comment: Cap Non-Pol SMD)
C26  value 100nF/25V  [CAP-SM-0805]  (hidden comment: Cap Non-Pol SMD)
C27  value 100nF/25V  [CAP-SM-0805]  (hidden comment: Cap Non-Pol SMD)
C28  value 1uF/25V  [CAP-SM-0805]  (hidden comment: Cap Non-Pol SMD)

### Blocks framed on the sheet
LDO: AMS1 C25-C28

### Nets
+3.3V: AMS1.2(VOUT) AMS1.4(VOUT) C27.2 C28.2
+5V_USB: AMS1.3(VIN) C25.2 C26.2
GND: AMS1.1(GND) C25.1 C26.1 C27.1 C28.1

### Library data of the parts
AMS1 = AMS1117 SMD: Dán; Value: AMS1117-3.3V SOT223; Don_Vi: Con; Ma_Hang: MH000596; Ghi_Chu: *; Kieu_Chan: *; Chung_Loai: Dán
C25-C28 = Cap Non-Pol SMD: Capacitor

## Nets that join several sheets
+3.3V: STM32 (23 pins), ESP32 (7 pins), PERIPHERAL (11 pins), RELAY (R14.2 R15.2 R18.2 R19.2), POWER_SUPPLY (AMS1.2 AMS1.4 C27.2 C28.2)
+5V_USB: USB (5 pins), RELAY (12 pins), POWER_SUPPLY (AMS1.3 C25.2 C26.2)
GND: STM32 (23 pins), ESP32 (7 pins), USB (7 pins), PERIPHERAL (9 pins), RELAY (Q4.2 Q5.2 Q6.2 Q7.2), POWER_SUPPLY (5 pins)
Net*1_3: ESP32 (*1.3 B3.1 C16.1 R6.2), USB (Q1.3)
Net*1_9: ESP32 (*1.9), PERIPHERAL (U6.10)
Net*1_10: ESP32 (*1.10), PERIPHERAL (U6.11)
Net*1_11: ESP32 (*1.11), PERIPHERAL (U5.4)
Net*1_12: ESP32 (*1.12), PERIPHERAL (U5.1)
Net*1_13: ESP32 (*1.13), PERIPHERAL (U5.5)
Net*1_14: ESP32 (*1.14), PERIPHERAL (U5.2)
Net*1_16: ESP32 (*1.16), PERIPHERAL (U5.3)
Net*1_25: ESP32 (*1.25 B4.1 C17.1 R7.2), USB (Q2.3)
Net*1_27: STM32 (U1.31), ESP32 (*1.27)
Net*1_28: STM32 (U1.30), ESP32 (*1.28)
Net*1_29: ESP32 (*1.29), PERIPHERAL (U6.12)
Net*1_30: ESP32 (*1.30), PERIPHERAL (U6.8)
Net*1_34: ESP32 (*1.34), USB (U4.3)
Net*1_35: ESP32 (*1.35), USB (U4.2)
Net*1_37: ESP32 (*1.37), PERIPHERAL (U6.9)
NetD4_1: STM32 (U1.46), PERIPHERAL (D4.1 R13.2)
NetD7_2: STM32 (U1.39), RELAY (D7.2)
NetD8_2: STM32 (U1.40), RELAY (D8.2)
NetD11_2: STM32 (U1.41), RELAY (D11.2)
NetD12_2: STM32 (U1.38), RELAY (D12.2)
NetR3_2: STM32 (R3.2 U1.43), PERIPHERAL (U7.4)
NetR4_2: STM32 (R4.2 U1.42), PERIPHERAL (U7.3)
NetR11_1: STM32 (U1.13), PERIPHERAL (R11.1 U8.2)
NetR12_1: STM32 (U1.14), PERIPHERAL (R12.1)
NetSW1_5: STM32 (U1.33), USB (SW1.5)
NetSW1_8: STM32 (U1.32), USB (SW1.8)
NetU1_10: STM32 (U1.10), PERIPHERAL (U10.1)
NetU1_11: STM32 (U1.11), PERIPHERAL (U10.2)
NetU1_12: STM32 (U1.12), PERIPHERAL (U10.3)